# EAGLE design brainmachine (EAGLE 7.5.0)
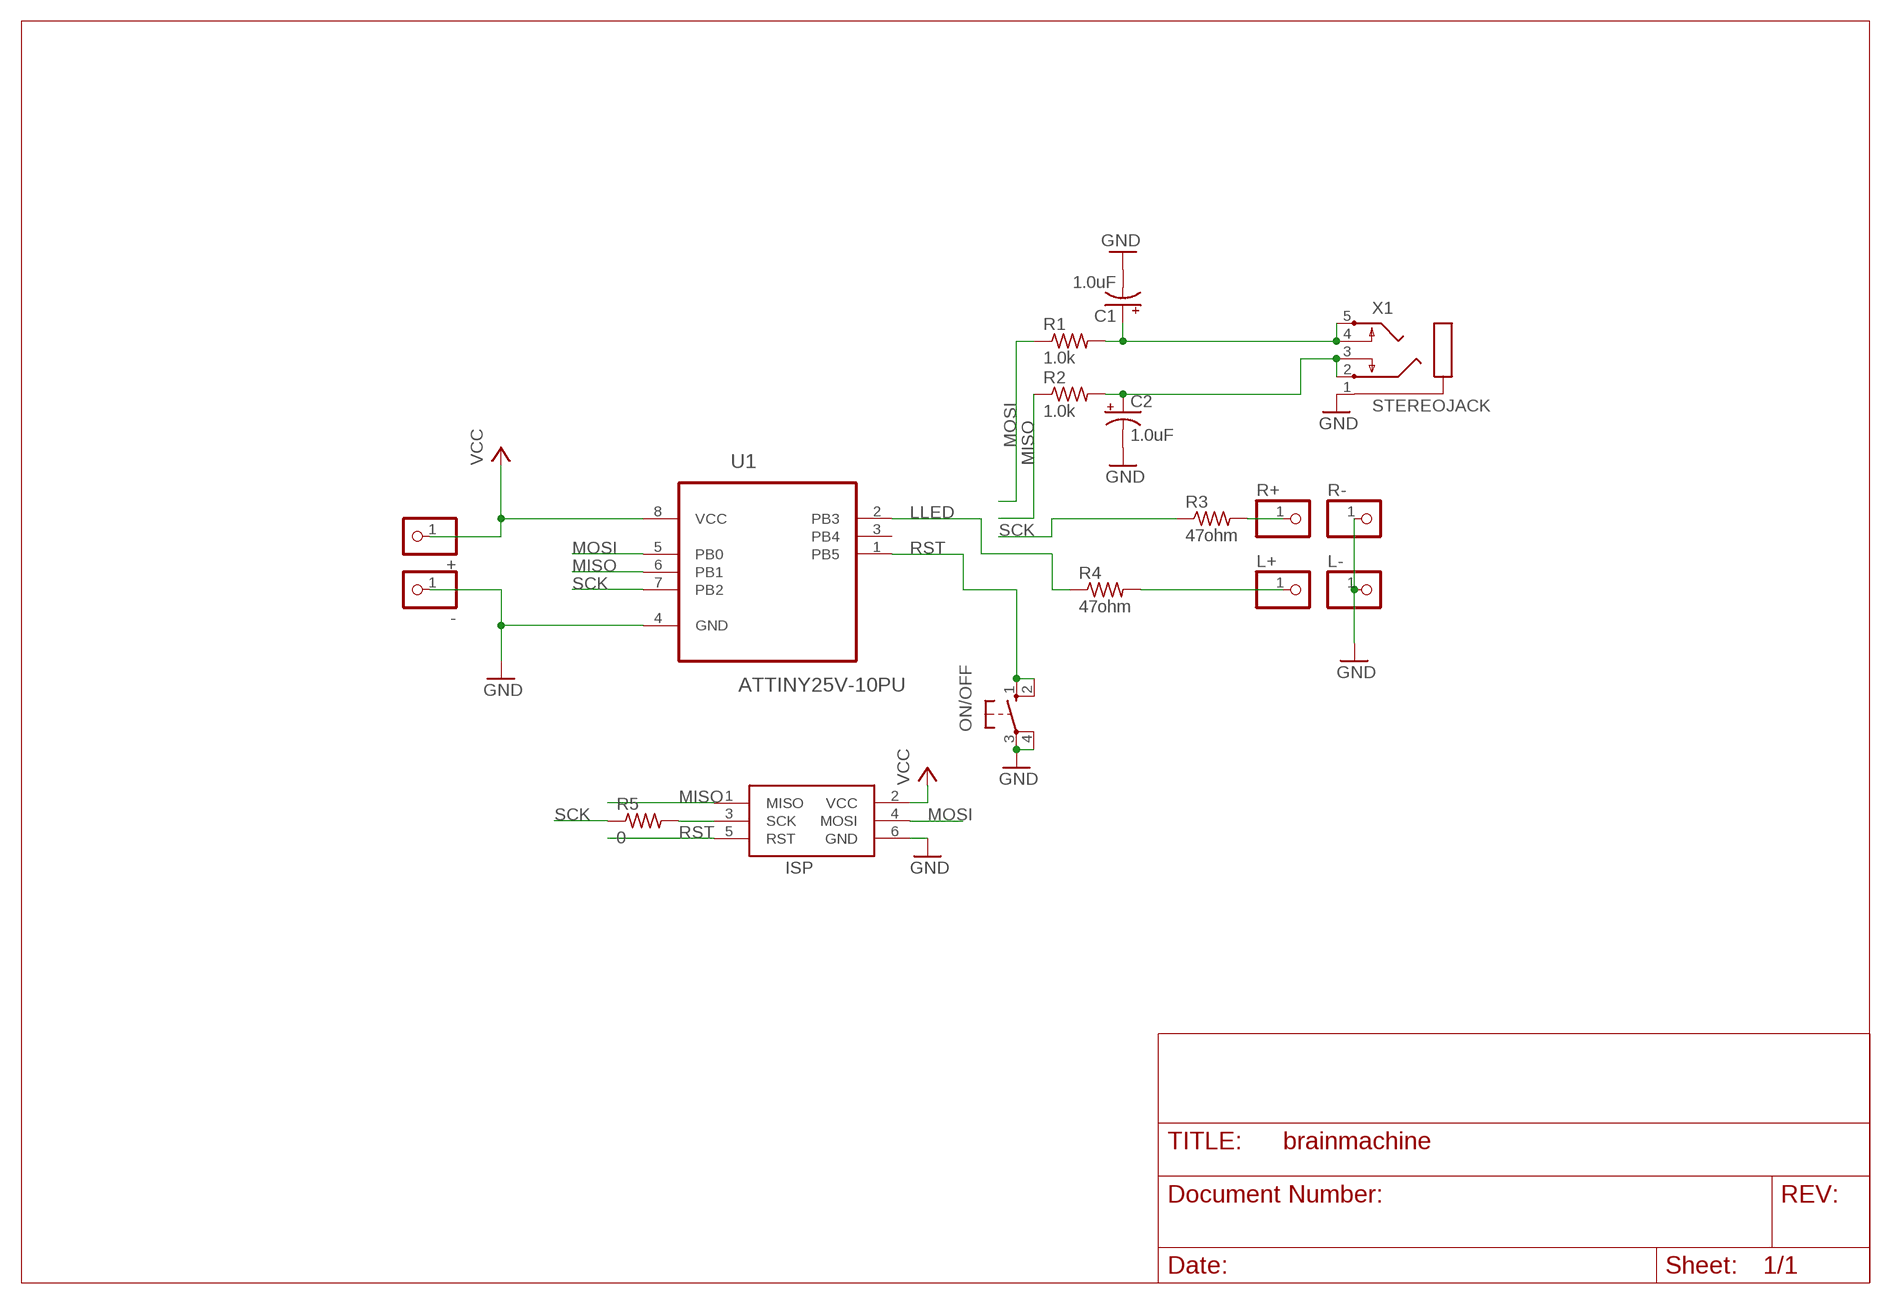
[diagram p0: schematic, sheet 1]

## Parts
+  PINHD-1X1  [1X01]
-  PINHD-1X1  [1X01]
C1  1.0uF  CPOL-USE2.5-5  [E2,5-5]
C2  1.0uF  CPOL-USE2.5-5  [E2,5-5]
ISP  AVRISP-6  [AVRISP]
L+  PINHD-1X1  [1X01]
L-  PINHD-1X1  [1X01]
ON/OFF  10-XX  [B3F-10XX]
R1  1.0k  R-US_0207/10  [0207/10]
R2  1.0k  R-US_0207/10  [0207/10]
R3  47ohm  R-US_0207/10  [0207/10]
R4  47ohm  R-US_0207/10  [0207/10]
R5  0  R-US_0207/10  [0207/10]
R+  PINHD-1X1  [1X01]
R-  PINHD-1X1  [1X01]
U1  ATTINY25V-10PU  [DIP254P762X533-8]
X1  STEREOJACK  [STX3100]

## Nets
GND: -.1 C1.- C2.- ISP.6(GND) L-.1 ON/OFF.3(P) ON/OFF.4(P1) R-.1 U1.4(GND) X1.1
LEYE+: L+.1 R4.2
LLED: R4.1 U1.2(PB3)
MISO: ISP.1(MISO) R2.1 U1.6(PB1)
MOSI: ISP.4(MOSI) R1.1 U1.5(PB0)
N$1: C1.+ R1.2 X1.4 X1.5
N$2: ISP.3(SCK) R5.2
N$3: C2.+ R2.2 X1.2 X1.3
N$9: R3.2 R+.1
RST: ISP.5(RST) ON/OFF.1(S) ON/OFF.2(S1) U1.1(PB5)
SCK: R3.1 R5.1 U1.7(PB2)
VCC: +.1 ISP.2(VCC) U1.8(VCC)
Unconnected: U1.3(PB4)

## Library data of the parts
+ - L+ L- R+ R- = adafruit:PINHD-1X1: Pin header 1x1 for 0.1" spacing With round pins
C1 C2 = adafruit:CPOL-US: POLARIZED CAPACITOR, American symbol
ISP = adafruit:AVRISP: AVR ISP HEADER Standard 6 pin header for AVR programming
ON/OFF = switch-omron:10-XX: OMRON SWITCH
R1-R5 = adafruit:R-US_: RESISTOR, American symbol
U1 = atmel-attiny25:ATTINY25V-10PU: 8-bit Microcontroller with 2/4/8KBytes In-System Programmable Flash; MPN: ATTINY25V-10PU; OC_FARNELL: 1455144; OC_NEWARK: 58M3780; PACKAGE: PDIP-8; SUPPLIER: Atmel
X1 = adafruit:STEREOJACK: MIC/HEADPHONE JACK Stereo jack with two switches. Kycon STX3100, CUI SJ1-3555NG and/or 4UCon 05544

## Board
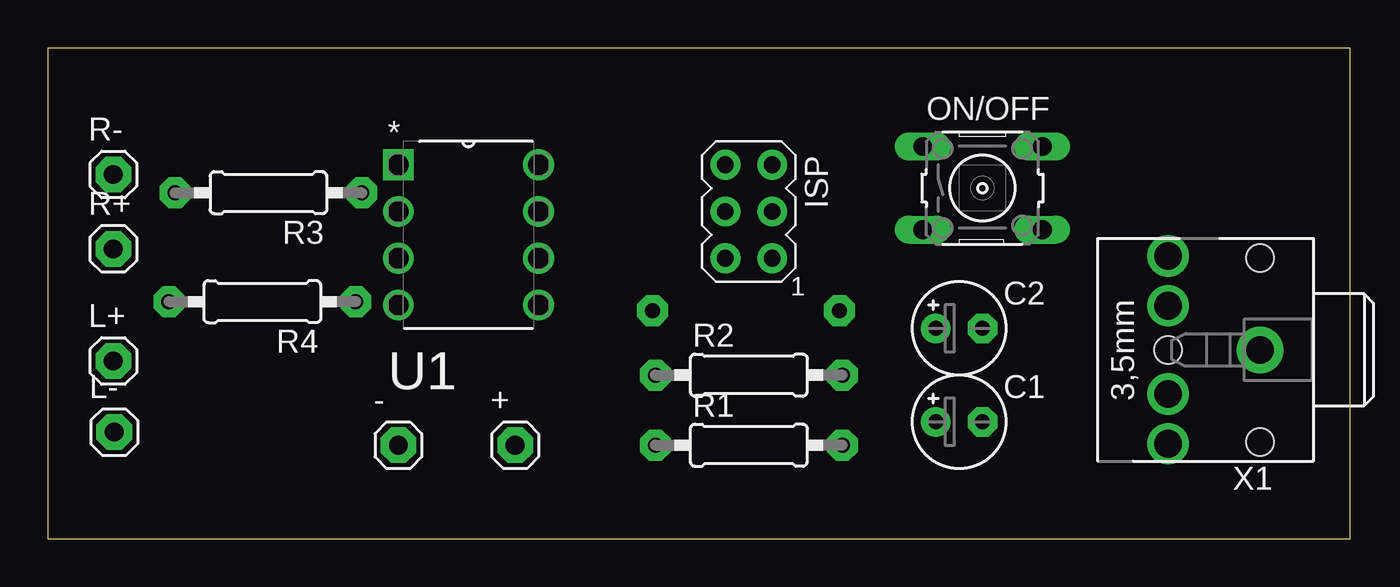
[diagram p1: board, top side]
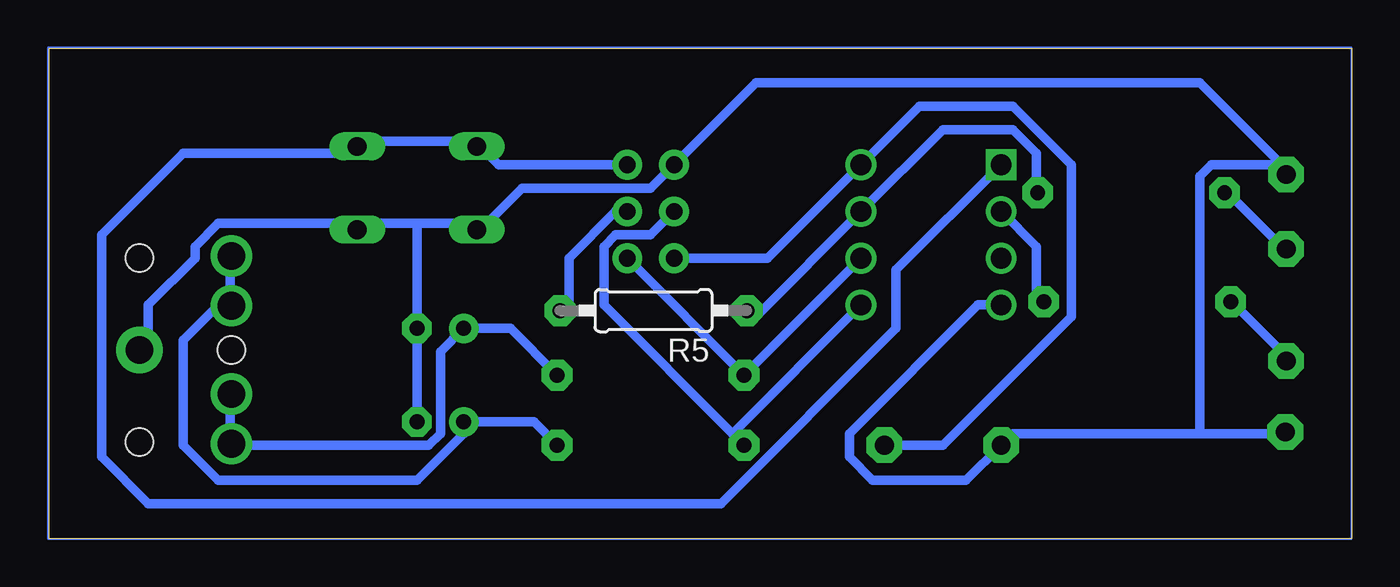
[diagram p2: board, bottom side, seen from below]

Size 70.79 x 26.66 mm. Coordinates in mm from the lower left corner, seen from the top.
Outline: 0,0 70.79,0 70.79,26.66 0,26.66 0,0
Copper layers (1*16): Top 0.035mm / dielectric 1.5mm / Bottom 0.035mm
Design rules "default *": minimum track width 20mil, minimum drill 24mil, track to track 8mil, track to pad 8mil, pad to pad 8mil, via to via 8mil, smd to smd 8mil, copper to edge 40mil, drill to drill 8mil, minimum pad ring 10mil, minimum via ring 8mil, stop-mask expansion 4mil, vias tented up to drill 0mil, thermal gap 10mil

### Footprints (pad centres in the part's own frame; a part is rotated, then mirrored left to right if it is on the bottom)
1X01 = drill 1.016 pad 1.93 octagon: 1 0,0
E2,5-5 = drill 0.813 pad 1.6: + -1.27,0 | drill 0.813 pad 1.6 octagon: - 1.27,0
AVRISP = drill 0.9 pad 1.626: 1 -1.27,2.54; 2 1.27,2.54; 3 -1.27,0; 4 1.27,0; 5 -1.27,-2.54; 6 1.27,-2.54
B3F-10XX = drill 1.016 long: 1 -3.251,2.261; 2 3.251,2.261; 3 -3.251,-2.261; 4 3.251,-2.261
0207/10 = drill 0.813 pad 1.676 octagon: 1 -5.08,0; 2 5.08,0
DIP254P762X533-8 = drill 1.118 square: 1 -7.62,7.62 | drill 1.118: 2 -7.62,5.08; 3 -7.62,2.54; 4 -7.62,0; 5 0,0; 6 0,2.54; 7 0,5.08; 8 0,7.62
STX3100 = drill 1.5 pad 2.54: 1 2.7,-0.1 | drill 1.5: 2 7.7,5; 3 7.7,2.3; 4 7.7,-2.5; 5 7.7,-5.2 | hole 1.5: 2.7,4.9; 2.7,-5.1; 7.7,-0.1

### Placement (x,y rotation side)
+  25.4,5.08 0 top
-  19.05,5.08 0 top
C1  49.53,6.35 0 top
C2  49.53,11.43 0 top
ISP  38.1,17.78 180 top
L+  3.56,9.65 0 top
L-  3.61,5.79 0 top
ON/OFF  50.8,19.05 0 top
R1  38.1,5.08 0 top
R2  38.1,8.89 0 top
R3  11.99,18.8 180 top
R4  11.66,12.88 180 top
R5  37.95,12.4 180 bottom
R+  3.56,15.75 0 top
R-  3.56,19.79 0 top
U1  26.67,12.7 0 top
X1  68.58,10.16 180 top

### Tracks (layer width: path | path; a pad name or v marks a point on that pad's centre or on a via)
GND
  Bottom 0.508: U1.4 20.32,12.7 27.3,5.71 27.3,4.45 26.03,3.17 20.95,3.17 -.1 18.41,5.71 8.26,5.71 | 8.26,5.71 3.81,5.71 L-.1 | 3.81,20.32 7.62,20.32 8.26,19.68 8.26,5.71 | C1.- C2.- 50.8,17.14 | 50.8,17.14 53.98,17.14 ON/OFF.4 54.61,17.14 61.59,17.14 62.86,15.88 62.86,15.24 65.41,12.7 65.41,10.79 X1.1 | 50.8,17.14 47.62,17.14 ON/OFF.3 46.99,17.14 45.09,19.05 38.1,19.05 ISP.6 32.39,24.77 8.26,24.77 3.81,20.32 | 3.81,20.32 R-.1
LEYE+
  Bottom 0.508: R4.2 6.35,12.7 3.81,10.16 L+.1
LLED
  Bottom 0.508: U1.2 17.15,15.88 17.15,13.34 R4.1
MISO
  Bottom 0.508: ISP.1 R2.1 U1.6
MOSI
  Bottom 0.508: ISP.4 38.1,16.51 40.01,16.51 40.64,15.88 40.64,12.7 33.66,5.71 | R1.1 33.66,5.71 | 33.66,5.71 U1.5
N$1
  Bottom 0.508: R1.2 44.45,6.35 C1.+ 48.26,5.71 50.8,3.17 61.59,3.17 63.5,5.08 63.5,10.79 60.96,13.34 | 60.96,13.34 60.96,15.24 X1.5 | 60.96,13.34 60.96,12.7 X1.4 60.96,13.34
N$2
  Bottom 0.508: ISP.3 40.01,17.78 42.55,15.24 42.55,12.7 R5.2
N$3
  Bottom 0.508: X1.3 60.96,7.62 60.96,5.71 X1.2 60.33,5.08 50.16,5.08 49.53,5.71 49.53,10.16 C2.+ 45.72,11.43 R2.2
N$4
  Bottom 0.1: 0,26.67 70.87,26.67 70.87,0 0,0 0,26.67
N$9
  Bottom 0.508: R3.2 6.35,18.41 3.81,15.88 R+.1
RST
  Bottom 0.508: ISP.5 46.36,20.32 46.99,20.95 ON/OFF.1 47.62,21.59 53.98,21.59 ON/OFF.2 54.61,20.95 63.5,20.95 67.95,16.51 67.95,4.45 65.41,1.91 34.29,1.91 24.77,11.43 24.77,14.61 U1.1
SCK
  Bottom 0.508: R5.1 32.39,12.06 U1.7 22.23,22.23 18.41,22.23 17.15,20.95 17.15,19.05 R3.1
VCC
  Bottom 0.508: ISP.2 31.75,15.24 U1.8 23.49,23.5 18.41,23.5 15.24,20.32 15.24,12.06 22.23,5.08 +.1